# Altium schematic sheet two_gnd_ports.SchDoc
size A4
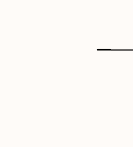
[diagram p0: two_gnd_ports.SchDoc, top left]
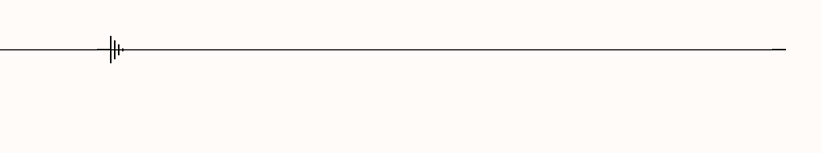
[diagram p1: two_gnd_ports.SchDoc, top right]
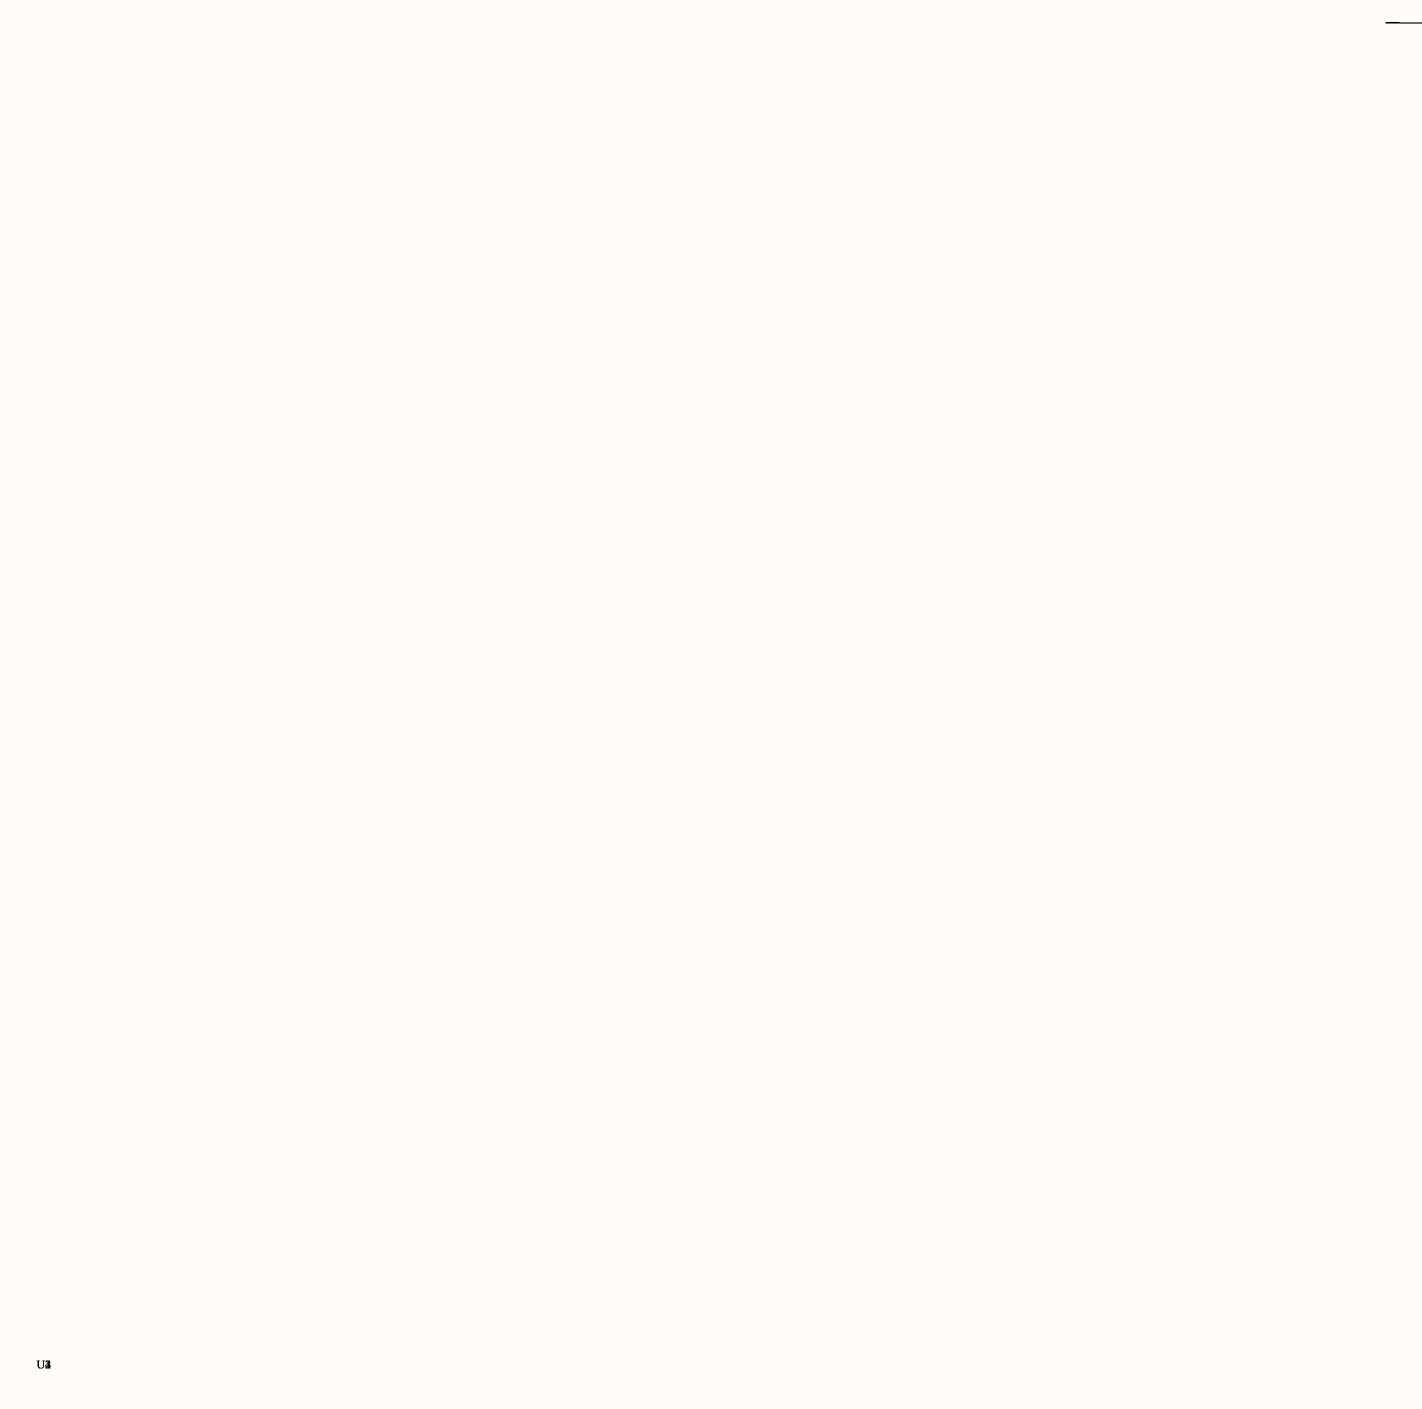
[diagram p2: two_gnd_ports.SchDoc, bottom left]
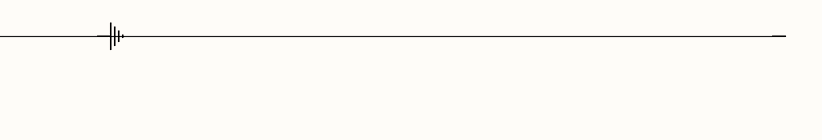
[diagram p3: two_gnd_ports.SchDoc, bottom right]

## Parts
U1  (no value)
U2  (no value)
U3  (no value)
U4  (no value)

## Nets
GND: U1.1(A) U2.1(B) U3.1(C) U4.1(D)

## Library data of the parts
U1-U4 = DEVICE